# EAGLE design PD_Filter_Amp (EAGLE 9.7.0)
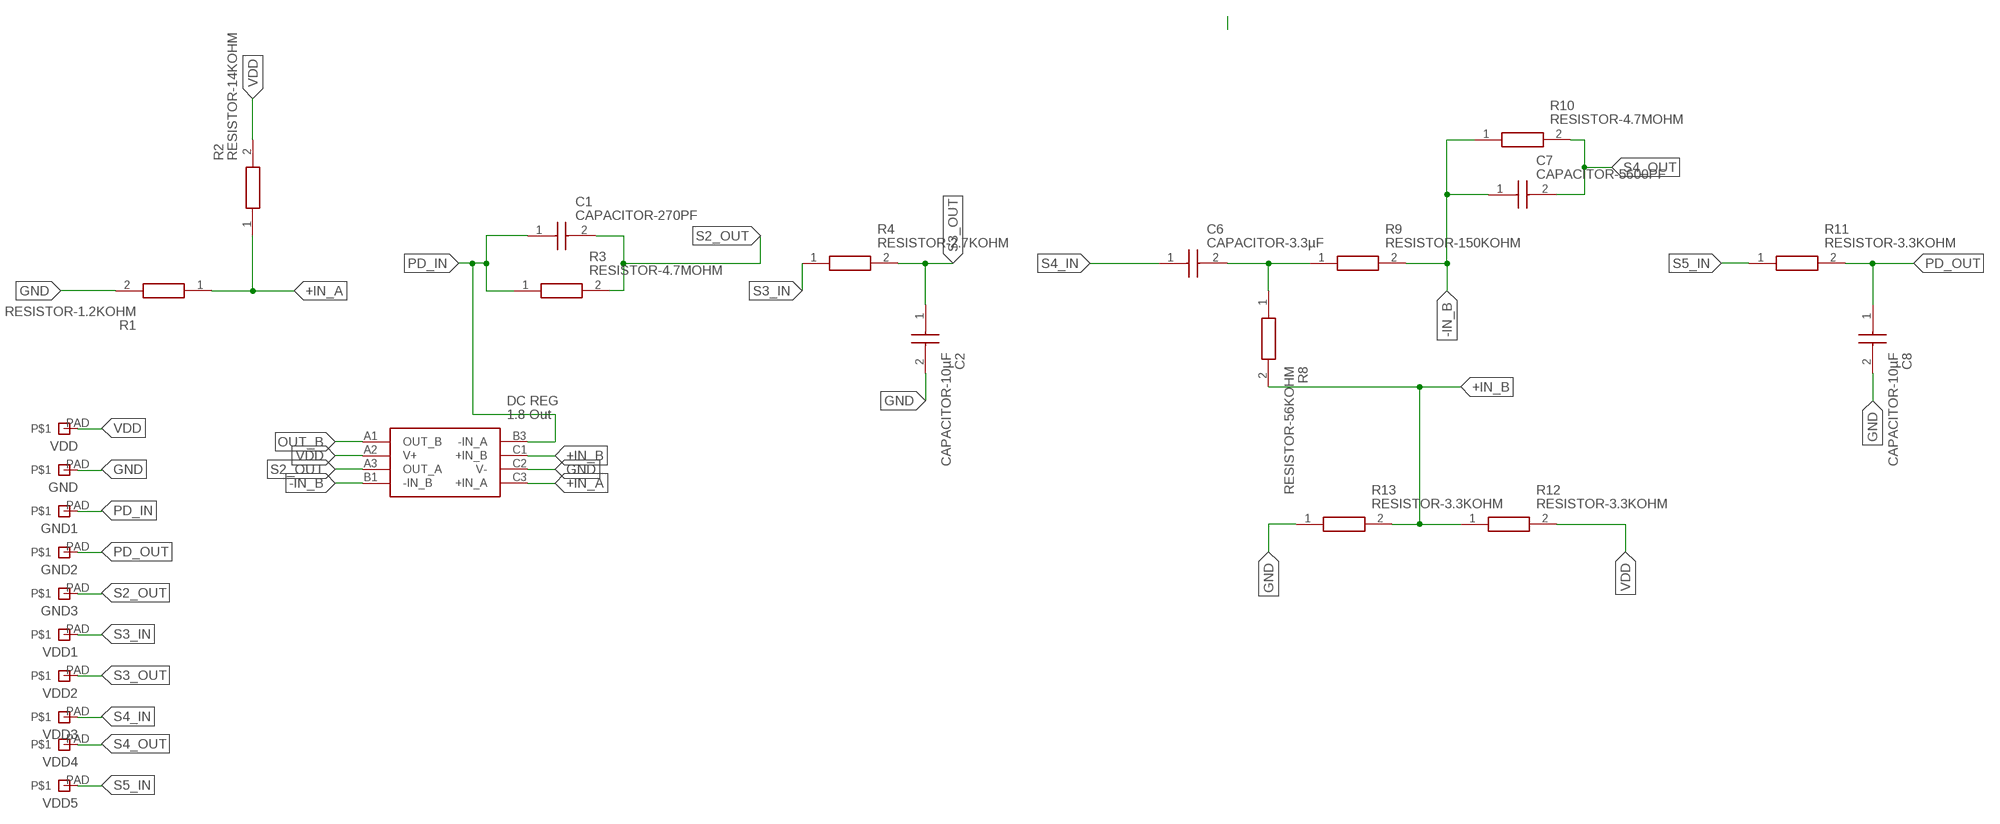
[diagram p0: schematic, sheet 1]

## Parts
C1  CAPACITOR-270PF  [CAPC1005X55N]
C2  CAPACITOR-10µF  [C0402]
C6  CAPACITOR-3.3µF  [C0402]
C7  CAPACITOR-5600PF  [CAPC1005X55N]
C8  CAPACITOR-10µF  [C0402]
GND  PAD  [PAD]
GND1  PAD  [PAD]
GND2  PAD  [PAD]
GND3  PAD  [PAD]
IC1  ADA4505-2  [BGA8C50P3X3_142X142X65]
R1  RESISTOR-1.2KOHM  [ERJPA2_(0402)]
R2  RESISTOR-14KOHM  [ERJ2RKD1004X]
R3  RESISTOR-4.7MOHM  [ERJ2RKD1004X]
R4  RESISTOR-2.7KOHM  [ERJPA2_(0402)]
R8  RESISTOR-56KOHM  [ERJ2RKD1004X]
R9  RESISTOR-150KOHM  [ERJS02_U02_(0402)]
R10  RESISTOR-4.7MOHM  [ERJ2RKD1004X]
R11  RESISTOR-3.3KOHM  [ERJPA2_(0402)]
R12  RESISTOR-3.3KOHM  [ERJPA2_(0402)]
R13  RESISTOR-3.3KOHM  [ERJPA2_(0402)]
VDD  PAD  [PAD]
VDD1  PAD  [PAD]
VDD2  PAD  [PAD]
VDD3  PAD  [PAD]
VDD4  PAD  [PAD]
VDD5  PAD  [PAD]

## Nets
+IN_A: IC1.C3(+IN_A) R1.1 R2.1
+IN_B: IC1.C1(+IN_B) R8.2 R12.1 R13.2
-IN_B: C7.1 IC1.B1(-IN_B) R9.2 R10.1
GND: C2.2 C8.2 GND.PAD IC1.C2(V-) R1.2 R13.1
N$8: C6.2 R8.1 R9.1
OUT_B: IC1.A1(OUT_B)
PD_IN: C1.1 GND1.PAD IC1.B3(-IN_A) R3.1
PD_OUT: C8.1 GND2.PAD R11.2
S2_OUT: C1.2 GND3.PAD IC1.A3(OUT_A) R3.2
S3_IN: R4.1 VDD1.PAD
S3_OUT: C2.1 R4.2 VDD2.PAD
S4_IN: C6.1 VDD3.PAD
S4_OUT: C7.2 R10.2 VDD4.PAD
S5_IN: R11.1 VDD5.PAD
VDD: IC1.A2(V+) R2.2 R12.2 VDD.PAD

## Library data of the parts
C1 = MABOS_Library:CAPACITOR-270PF: SMD Comm C0G, Ceramic, 270 pF, 2%, 50 VDC, 125 VDC, 125C, -55C, C0G, SMD, MLCC, Ultra-Stable, Low Loss, Class I, 0.1 % , 100 GOhms, 1.06 mg, 0402, 1mm, 0.5mm, 0.5mm, 0.3mm, 0.3mm, 10000, 78 Weeks, 120 Source: Datasheet <https://componentsearchengine.com/Datasheets/1/C0402C271G5GACTU.pdf>; DESCRIPTION: SMD Comm C0G, Ceramic, 270 pF, 2%, 50 VDC, 125 VDC, 125C, -55C, C0G, SMD, MLCC, Ultra-Stable, Low Loss, Class I, 0.1 % , 100 GOhms, 1.06 mg, 0402, 1mm, 0.5mm, 0.5mm, 0.3mm, 0.3mm, 10000, 78 Weeks, 120; HEIGHT: 0.55mm; MANUFACTURER_NAME: KEMET; MANUFACTURER_PART_NUMBER: C0402C271G5GACTU; MOUSER_PART_NUMBER: 80-C0402C271G5G; MOUSER_PRICE-STOCK: https://www.mouser.com/Search/Refine.aspx?Keyword=80-C0402C271G5G
C2 C8 = MABOS_Library:CAPACITOR-10µF: SMD Comm X5R, Ceramic, 10 uF, 20%, 6.3 VDC, 15.75 VDC, 85C, -55C, X5R, SMD, MLCC, Temperature Stable, Class II, 10 % , 10 MOhms, 1.41 mg, 0402, 1mm, 0.5mm, 0.5mm, 0.3mm, 0.3mm, 10000, 78 Weeks, 70 Source: Datasheet <https://content.kemet.com/datasheets/KEM_C1006_X5R_SMD.pdf>; DESCRIPTION: SMD Comm X5R, Ceramic, 10 uF, 20%, 6.3 VDC, 15.75 VDC, 85C, -55C, X5R, SMD, MLCC, Temperature Stable, Class II, 10 % , 10 MOhms, 1.41 mg, 0402, 1mm, 0.5mm, 0.5mm, 0.3mm, 0.3mm, 10000, 78 Weeks, 70; HEIGHT: 0.55mm; MANUFACTURER_NAME: KEMET; MANUFACTURER_PART_NUMBER: C0402C106M9PACTU; MOUSER_PART_NUMBER: 80-C0402C106M9P; MOUSER_PRICE-STOCK: https://www.mouser.co.uk/ProductDetail/KEMET/C0402C106M9PACTU?qs=x4XeXhDQKnp%252Bz0lMlwMC3A%3D%3D
C6 = MABOS_Library:CAPACITOR-3.3µF: SMD Comm X5R, Ceramic, 3.3 uF, 20%, 4 VDC, 10 VDC, 85C, -55C, X5R, SMD, MLCC, Temperature Stable, Class II, 10 % , 30.3 MOhms, 1.21 mg, 0402, 1mm, 0.5mm, 0.5mm, 0.3mm, 0.3mm, 10000, 78 Weeks, 70 Source: Datasheet <https://content.kemet.com/datasheets/KEM_C1006_X5R_SMD.pdf>; DESCRIPTION: SMD Comm X5R, Ceramic, 3.3 uF, 20%, 4 VDC, 10 VDC, 85C, -55C, X5R, SMD, MLCC, Temperature Stable, Class II, 10 % , 30.3 MOhms, 1.21 mg, 0402, 1mm, 0.5mm, 0.5mm, 0.3mm, 0.3mm, 10000, 78 Weeks, 70; HEIGHT: 0.55mm; MANUFACTURER_NAME: KEMET; MANUFACTURER_PART_NUMBER: C0402C335M7PACTU; MOUSER_PART_NUMBER: 80-C0402C335M7P; MOUSER_PRICE-STOCK: https://www.mouser.co.uk/ProductDetail/KEMET/C0402C335M7PACTU?qs=K%2Fj%2Fqf%252B0fqJuKSSbbJXSEQ%3D%3D
C7 = MABOS_Library:CAPACITOR-5600PF: SMD Comm X7R, Ceramic, 5600 pF, 5%, 16 VDC, 40 VDC, 125C, -55C, X7R, SMD, MLCC, Temperature Stable, Class II, 3.5 % , 100 GOhms, 1.21 mg, 0402, 1mm, 0.5mm, 0.5mm, 0.3mm, 0.3mm, 10000, 78 Weeks, 80 Source: Datasheet <https://content.kemet.com/datasheets/KEM_C1002_X7R_SMD.pdf>; DESCRIPTION: SMD Comm X7R, Ceramic, 5600 pF, 5%, 16 VDC, 40 VDC, 125C, -55C, X7R, SMD, MLCC, Temperature Stable, Class II, 3.5 % , 100 GOhms, 1.21 mg, 0402, 1mm, 0.5mm, 0.5mm, 0.3mm, 0.3mm, 10000, 78 Weeks, 80; HEIGHT: 0.55mm; MANUFACTURER_NAME: KEMET; MANUFACTURER_PART_NUMBER: C0402C562J4RACTU; MOUSER_PART_NUMBER: 80-C0402C562J4R; MOUSER_PRICE-STOCK: https://www.mouser.co.uk/ProductDetail/KEMET/C0402C562J4RACTU?qs=YJD0VjdmSUns5e35Blws8w%3D%3D
GND GND1-GND3 VDD VDD1-VDD5 = Nordic_BLE:PAD
IC1 = MABOS_Library:ADA4505-2: Op Amp (2); DESCRIPTION: ANALOG DEVICES - ADA4505-2ACBZ-R7 - OP-AMP, DUAL, 50KHZ, WLCSP-8; HEIGHT: 0.65mm; MANUFACTURER_NAME: Analog Devices; MANUFACTURER_PART_NUMBER: ADA4505-2ACBZ-R7; MOUSER_PART_NUMBER: 584-ADA4505-2ACBZ-R7; MOUSER_PRICE-STOCK: https://www.mouser.co.uk/ProductDetail/Analog-Devices/ADA4505-2ACBZ-R7?qs=BpaRKvA4VqEsLtXU3NSLDQ%3D%3D
R1 = MABOS_Library:RESISTOR-1.2KOHM: Anti-Surge Thick Film Chip Resistor, 0402, 0.2W Source: Datasheet <https://componentsearchengine.com/Datasheets/1/ERJ-PA2D1201X.pdf>; DESCRIPTION: Anti-Surge Thick Film Chip Resistor, 0402, 0.2W; HEIGHT: 0.4mm; MANUFACTURER_NAME: Panasonic; MANUFACTURER_PART_NUMBER: ERJ-PA2D1201X; MOUSER_PART_NUMBER: 667-ERJ-PA2D1201X; MOUSER_PRICE-STOCK: https://www.mouser.com/Search/Refine.aspx?Keyword=667-ERJ-PA2D1201X
R2 = MABOS_Library:RESISTOR-14KOHM: Panasonic ERJ2RK Series Thick Film Resistor 14k +/-1% 0.1W +/-100ppm/C Source: Datasheet <https://componentsearchengine.com/Datasheets/1/ERJ-2RKF1402X.pdf>; DESCRIPTION: Panasonic ERJ2RK Series Thick Film Resistor 14k +/-1% 0.1W +/-100ppm/C; HEIGHT: 0.4mm; MANUFACTURER_NAME: Panasonic; MANUFACTURER_PART_NUMBER: ERJ-2RKF1402X; MOUSER_PART_NUMBER: 667-ERJ-2RKF1402X; MOUSER_PRICE-STOCK: https://www.mouser.com/Search/ProductDetail.aspx?qs=MVjVSMjNRMrMgFTFLdW36A%3d%3d
R3 R10 = MABOS_Library:RESISTOR-4.7MOHM: Panasonic ERJ2GEJ Series Thick Film Surface Mount Fixed Resistor 0402 Case 4.7M +/-5% 0.1W -400 +150ppm/C Source: Datasheet <https://componentsearchengine.com/Datasheets/1/ERJ-2GEJ475X.pdf>; DESCRIPTION: Panasonic ERJ2GEJ Series Thick Film Surface Mount Fixed Resistor 0402 Case 4.7M +/-5% 0.1W -400 +150ppm/C; HEIGHT: 0.4mm; MANUFACTURER_NAME: Panasonic; MANUFACTURER_PART_NUMBER: ERJ-2GEJ475X; MOUSER_PART_NUMBER: 667-ERJ-2GEJ475X; MOUSER_PRICE-STOCK: https://www.mouser.com/Search/Refine.aspx?Keyword=667-ERJ-2GEJ475X
R4 = MABOS_Library:RESISTOR-2.7KOHM: Anti-Surge Thick Film Chip Resistor, 0402, 0.2W Source: Datasheet <http://industrial.panasonic.com/cdbs/www-data/pdf/RDO0000/AOA0000C331.pdf>; DESCRIPTION: Anti-Surge Thick Film Chip Resistor, 0402, 0.2W; HEIGHT: 0.4mm; MANUFACTURER_NAME: Panasonic; MANUFACTURER_PART_NUMBER: ERJ-PA2F2701X
R8 = MABOS_Library:RESISTOR-56KOHM: Precision Thick Film Chip Resistor, 0402, 0.063W Source: Datasheet <https://componentsearchengine.com/Datasheets/1/ERJ-2RKF5602X.pdf>; DESCRIPTION: Precision Thick Film Chip Resistor, 0402, 0.063W; HEIGHT: 0.4mm; MANUFACTURER_NAME: Panasonic; MANUFACTURER_PART_NUMBER: ERJ-2RKF5602X; MOUSER_PART_NUMBER: 667-ERJ-2RKF5602X; MOUSER_PRICE-STOCK: https://www.mouser.com/Search/Refine.aspx?Keyword=667-ERJ-2RKF5602X
R9 = MABOS_Library:RESISTOR-150KOHM: Anti-Sulfurated Thick Film Chip Resistor, 0402, 0.1W Source: Datasheet <https://componentsearchengine.com/Datasheets/1/ERJ-U02D1503X.pdf>; DESCRIPTION: Anti-Sulfurated Thick Film Chip Resistor, 0402, 0.1W; HEIGHT: 0.4mm; MANUFACTURER_NAME: Panasonic; MANUFACTURER_PART_NUMBER: ERJ-U02D1503X; MOUSER_PART_NUMBER: 667-ERJ-U02D1503X; MOUSER_PRICE-STOCK: https://www.mouser.com/Search/Refine.aspx?Keyword=667-ERJ-U02D1503X
R11-R13 = MABOS_Library:RESISTOR-3.3KOHM: Anti-Surge Thick Film Chip Resistor, 0402, 0.2W Source: Datasheet <https://componentsearchengine.com/Datasheets/1/ERJ-PA2F3301X.pdf>; DESCRIPTION: Anti-Surge Thick Film Chip Resistor, 0402, 0.2W; HEIGHT: 0.4mm; MANUFACTURER_NAME: Panasonic; MANUFACTURER_PART_NUMBER: ERJ-PA2F3301X; MOUSER_PART_NUMBER: 667-ERJ-PA2F3301X; MOUSER_PRICE-STOCK: https://www.mouser.com/Search/Refine.aspx?Keyword=667-ERJ-PA2F3301X

## Board
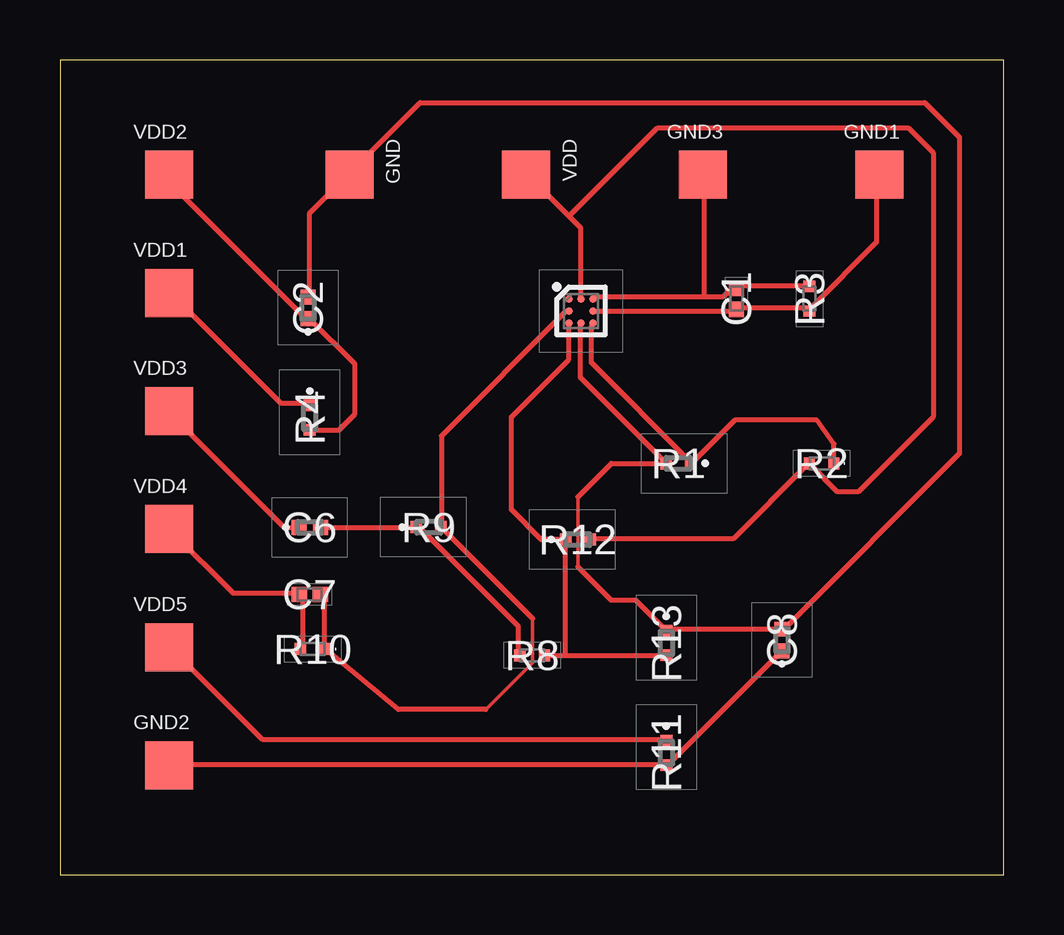
[diagram p1: board, top side]

Size 39.35 x 33.96 mm. Coordinates in mm from the lower left corner, seen from the top.
Outline: 0,0 39.35,0 39.35,33.96 0,33.96 0,0
Copper layers (1*16): Top 0.035mm / dielectric 1.5mm / Bottom 0.035mm
Design rules "default": minimum track width 6mil, minimum drill 0.35mm, track to track 6mil, track to pad 6mil, pad to pad 6mil, via to via 6mil, smd to smd 6mil, copper to edge 40mil, drill to drill 6mil, minimum pad ring 10mil, minimum via ring 8mil, stop-mask expansion 4mil, vias tented up to drill 0mil, thermal gap 10mil

### Footprints (pad centres in the part's own frame; a part is rotated, then mirrored left to right if it is on the bottom)
CAPC1005X55N = smd 0.65 x 0.62: 1 -0.44,0; 2 0.44,0
C0402 = smd 0.62 x 0.62: 1 -0.45,0; 2 0.45,0
PAD = smd 2 x 2: PAD 0,0
BGA8C50P3X3_142X142X65 = smd 0.306 x 0.306: A1 -0.5,0.5; A2 0,0.5; A3 0.5,0.5; B1 -0.5,0; B3 0.5,0; C1 -0.5,-0.5; C2 0,-0.5; C3 0.5,-0.5
ERJPA2_(0402) = smd 0.475 x 0.5: 1 -0.512,0; 2 0.512,0
ERJ2RKD1004X = smd 0.475 x 0.5: 1 -0.512,0; 2 0.512,0
ERJS02_U02_(0402) = smd 0.475 x 0.5: 1 -0.512,0; 2 0.512,0

### Placement (x,y rotation side)
C1  28.19,24 90 top
C2  10.34,23.63 90 top
C6  10.41,14.48 0 top
C7  10.41,11.68 180 top
C8  30.1,9.78 90 top
GND  12.06,29.17 270 top
GND1  34.16,29.17 0 top
GND2  4.56,4.56 0 top
GND3  26.8,29.17 0 top
IC1  21.72,23.5 0 top
R1  25.78,17.14 180 top
R2  31.75,17.14 180 top
R3  31.24,24 90 top
R4  10.41,19.05 270 top
R8  19.68,9.14 0 top
R9  15.37,14.48 0 top
R10  10.54,9.4 180 top
R11  25.27,5.08 270 top
R12  21.59,13.97 0 top
R13  25.27,9.65 270 top
VDD  19.43,29.17 270 top
VDD1  4.56,24.25 0 top
VDD2  4.56,29.17 0 top
VDD3  4.56,19.33 0 top
VDD4  4.56,14.4 0 top
VDD5  4.56,9.48 0 top

### Tracks (layer width: path | path; a pad name or v marks a point on that pad's centre or on a via)
+IN_A
  Top 0.203: IC1.C3 22.15,22.86 22.15,21.34 26.26,17.22 R1.1 26.42,17.22 28.14,18.95 31.55,18.95 32.26,17.96 R2.1
+IN_B
  Top 0.203: R8.2 21.08,9.14 | 21.08,9.14 25.2,9.14 R13.2 | IC1.C1 21.22,21.47 18.82,19.07 18.82,15.21 20.06,13.97 R12.1 21.08,13.87 21.08,9.14
-IN_B
  Top 0.152: 19.71,10.67 19.71,8.83 17.76,6.88
  Top 0.203: C7.1 10.87,11.58 11.02,11.43 11.02,9.45 R10.1 14.1,6.88 17.76,6.88 | IC1.B1 21.08,23.47 15.9,18.29 15.9,14.63 R9.2 15.9,14.48 19.71,10.67
GND
  Top 0.152: 21.59,12.83 21.59,15.75
  Top 0.203: IC1.C2 21.69,22.86 21.69,20.73 25.2,17.22 R1.2 22.99,17.14 21.59,15.75 | C2.2 10.41,24.23 10.41,27.58 11.94,29.11 GND.PAD 12.09,29.26 15.01,32.18 36.04,32.18 37.49,30.73 37.49,17.55 30.17,10.23 C8.2 30.07,10.21 25.35,10.21 R13.1 24.01,11.43 22.99,11.43 21.59,12.83
N$8
  Top 0.203: R8.1 19.1,9.14 19.1,10.36 14.99,14.48 R9.1 14.83,14.48 C6.2
PD_IN
  Top 0.203: IC1.B3 22.3,23.47 28.09,23.47 C1.1 28.25,23.62 31.14,23.62 R3.1 31.29,23.62 34.04,26.37 34.04,29.11 GND1.PAD
PD_OUT
  Top 0.203: C8.1 30.07,9.3 25.35,4.57 R11.2 25.2,4.57 4.62,4.57 GND2.PAD
S2_OUT
  Top 0.203: 26.87,24.08 27.63,24.08 28.09,24.54 C1.2 28.25,24.54 31.14,24.54 R3.2 | 26.87,24.08 22.3,24.08 IC1.A3 | 26.87,24.08 26.87,29.11 GND3.PAD
S3_IN
  Top 0.203: R4.1 10.41,19.66 9.2,19.66 4.62,24.23 VDD1.PAD
S3_OUT
  Top 0.203: R4.2 11.63,18.54 12.29,19.2 12.29,21.29 10.41,23.16 C2.1 10.26,23.16 4.62,28.8 4.62,29.11 VDD2.PAD
S4_IN
  Top 0.203: C6.1 9.35,14.48 4.62,19.2 VDD3.PAD
S4_OUT
  Top 0.203: R10.2 10.11,9.45 10.11,11.58 C7.2 9.96,11.73 7.21,11.73 4.62,14.33 VDD4.PAD
S5_IN
  Top 0.203: R11.1 25.2,5.64 8.43,5.64 4.62,9.45 VDD5.PAD
VDD
  Top 0.203: 21.22,27.45 19.56,29.11 VDD.PAD | 21.22,27.45 21.69,26.98 21.69,24.08 IC1.A2 | R12.2 22.15,14.02 28.09,14.02 31.14,17.07 R2.2 31.29,17.07 32.38,15.98 33.3,15.98 36.42,19.1 36.42,30.07 35.38,31.12 24.89,31.12 21.22,27.45